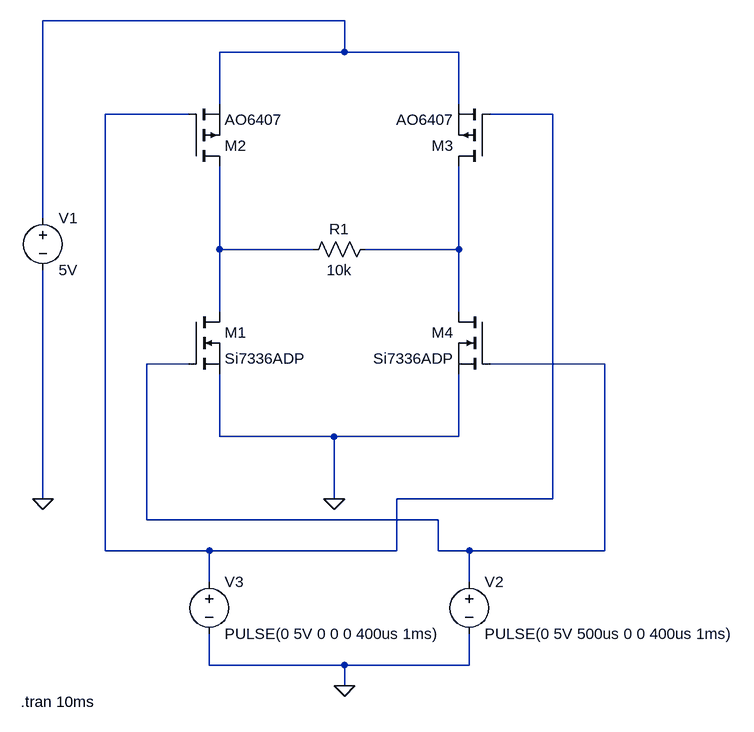
[diagram p0: schematic comutador-ponte-h.asc]
comutador-ponte-h.asc, the LTspice schematic file:
Version 4
SHEET 1 1660 856
WIRE 1040 -208 576 -208
WIRE 1040 -160 1040 -208
WIRE 1040 -160 848 -160
WIRE 1216 -160 1040 -160
WIRE 848 -80 848 -160
WIRE 1216 -80 1216 -160
WIRE 800 -64 672 -64
WIRE 1360 -64 1264 -64
WIRE 576 96 576 -208
WIRE 848 144 848 16
WIRE 992 144 848 144
WIRE 1216 144 1216 16
WIRE 1216 144 1072 144
WIRE 848 240 848 144
WIRE 1216 240 1216 144
WIRE 800 320 736 320
WIRE 1440 320 1264 320
WIRE 848 432 848 336
WIRE 1024 432 848 432
WIRE 1216 432 1216 336
WIRE 1216 432 1024 432
WIRE 576 528 576 176
WIRE 1024 528 1024 432
WIRE 1360 528 1360 -64
WIRE 1360 528 1120 528
WIRE 736 560 736 320
WIRE 1184 560 736 560
WIRE 672 608 672 -64
WIRE 832 608 672 608
WIRE 1120 608 1120 528
WIRE 1120 608 832 608
WIRE 1184 608 1184 560
WIRE 1232 608 1184 608
WIRE 1440 608 1440 320
WIRE 1440 608 1232 608
WIRE 832 656 832 608
WIRE 1232 656 1232 608
WIRE 832 784 832 736
WIRE 1040 784 832 784
WIRE 1232 784 1232 736
WIRE 1232 784 1040 784
WIRE 1040 816 1040 784
FLAG 576 528 0
FLAG 1024 528 0
FLAG 1040 816 0
SYMBOL voltage 576 80 R0
WINDOW 123 0 0 Left 0
WINDOW 39 0 0 Left 0
SYMATTR InstName V1
SYMATTR Value 5V
SYMBOL voltage 1232 640 R0
WINDOW 123 0 0 Left 0
WINDOW 39 0 0 Left 0
SYMATTR InstName V2
SYMATTR Value PULSE(0 5V 500us 0 0 400us 1ms)
SYMBOL voltage 832 640 R0
WINDOW 123 0 0 Left 0
WINDOW 39 0 0 Left 0
SYMATTR InstName V3
SYMATTR Value PULSE(0 5V 0 0 0 400us 1ms)
SYMBOL nmos 800 240 R0
SYMATTR InstName M1
SYMATTR Value Si7336ADP
SYMBOL nmos 1264 240 M0
SYMATTR InstName M4
SYMATTR Value Si7336ADP
SYMBOL res 1088 128 R90
WINDOW 0 0 56 VBottom 2
WINDOW 3 32 56 VTop 2
SYMATTR InstName R1
SYMATTR Value 10k
SYMBOL pmos 800 16 M180
SYMATTR InstName M2
SYMATTR Value AO6407
SYMBOL pmos 1264 16 R180
SYMATTR InstName M3
SYMATTR Value AO6407
TEXT 542 840 Left 2 !.tran 10ms

The netlist it stands for:
* comutador-ponte-h.asc
V1 N001 0 5V
V2 N005 0 PULSE(0 5V 500us 0 0 400us 1ms)
V3 N002 0 PULSE(0 5V 0 0 0 400us 1ms)
M1 N003 N005 0 0 Si7336ADP
M4 N004 N005 0 0 Si7336ADP
R1 N004 N003 10k
M2 N003 N002 N001 N001 AO6407
M3 N004 N002 N001 N001 AO6407
.model NMOS NMOS
.model PMOS PMOS
.lib standard.mos
.tran 10ms
.backanno
.end